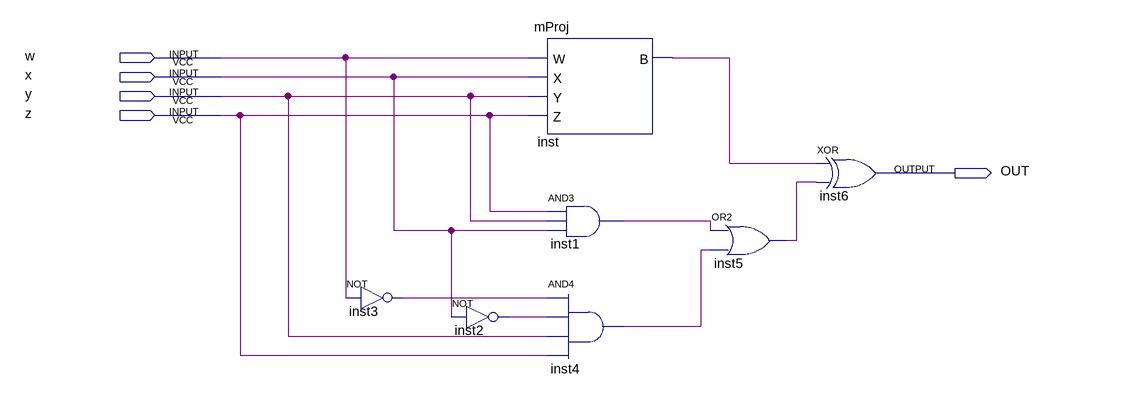
[diagram p0: schematic sheet]
// Quartus schematic Block2.bdf as structural Verilog: 7 symbols, 5 pins
module Block2 (
  input  w,
  input  x,
  input  y,
  input  z,
  output OUT
);

  wire inst1_out, inst2_out, inst3_out, inst4_out, inst5_out, inst_b;

  not inst3 (inst3_out, w);
  not inst2 (inst2_out, x);
  mProj inst (.W(w), .X(x), .Y(y), .Z(z), .B(inst_b));
  and inst1 (inst1_out, z, y, x);
  and inst4 (inst4_out, inst3_out, inst2_out, y, z);
  or inst5 (inst5_out, inst1_out, inst4_out);
  xor inst6 (OUT, inst_b, inst5_out);
endmodule
